# Altium schematic sheet HUM_SENS.SchDoc
size 420 x 297 mm; Scale: {Масш.}; Title1str: {Наименование}; PageSetup: Record=PageOptions|CenterHorizontal=False|CenterVertical=False|PrintScale=0.67|XCorrection=0.00|YCorrection=0.00|PrintKind=1|BorderSize=5000000|LeftOffset=0|BottomOffset=0|Orientation=2|PaperLength=1000|PaperWidth=1000|Scale=100|PaperSource=7|PrintQuality=600|MediaType=1|DitherType=10|PaperKind=A4|PrintScaleMode=1; Title2str: {Наименование}; ProcessInspection: {Т.контр.}; Mass: {Масса}; NormInspection: {Н.контр.}; EngineerName: {Инженер}; Letter1Column: {}; Letter2Column: {}; Letter3Column: {}; DocumentType: ?????????????? ?????; DocumentType1str: {Документ}; DocumentType2str: {Документ}
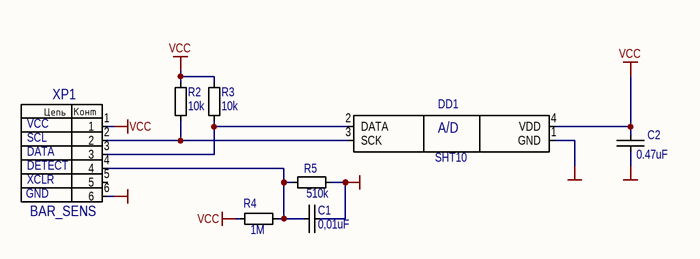
[diagram p0: HUM_SENS.SchDoc]

## Parts
C1  0,01uF  [Cap_0805]
C2  0.47uF  [Cap_0805]
DD1  SHT10  [SHT10]
R2  10k  [Res_0805]
R3  10k  [Res_0805]
R4  1M  [Res_0805]
R5  510k  [Res_0805]
XP1  BAR_SENS  [SENS_LEGS]

## Nets
GND: C1.2 C2.1 DD1.1(GND) R5.1 XP1.6
VCC: C2.2 DD1.4(VDD) R2.1 R3.1 R4.2 XP1.1
NetC1_1: C1.1 R4.1 R5.2 XP1.4
NetDD1_2: DD1.2(DATA) R3.2 XP1.3
NetDD1_3: DD1.3(SCK) R2.2 XP1.2

Not connected (* = marked no-connect by the designer): XP1 5

## Notes on the sheet
- (near XP1) DETECT
- (near XP1) DATA
- (near XP1) SCL
- (near XP1) VCC
- (near XP1) XCLR
- GND
- (in symbol SHT10) A/D

## Library data of the parts
C1 = Cap_0805: Manufacturer: AVX; Part Number: 08055C103JAT2A; Replacement: GRM2195C1H103JA01D; Value: 0.01uF; PackageReference: 0805; Distributor: http://www.chipel.ru/; Price: 0.30
C2 = Cap_0805: Manufacturer: AVX; Part Number: 0805YC475KAT2A; Replacement: GRM21BR61E475KA12L; Value: 1uF; PackageReference: 0805; Distributor: http://www.kontest.ru; Price: 9.53
R2-R5 = Res_0805: Manufacturer: Vishay; Replacement: 0.30; PackageReference: 0805; Distributor: http://www.kontest.ru; Price: Price
  R2 R3: Value: 10k
  R4: Value: 1M
  R5: Value: 510k